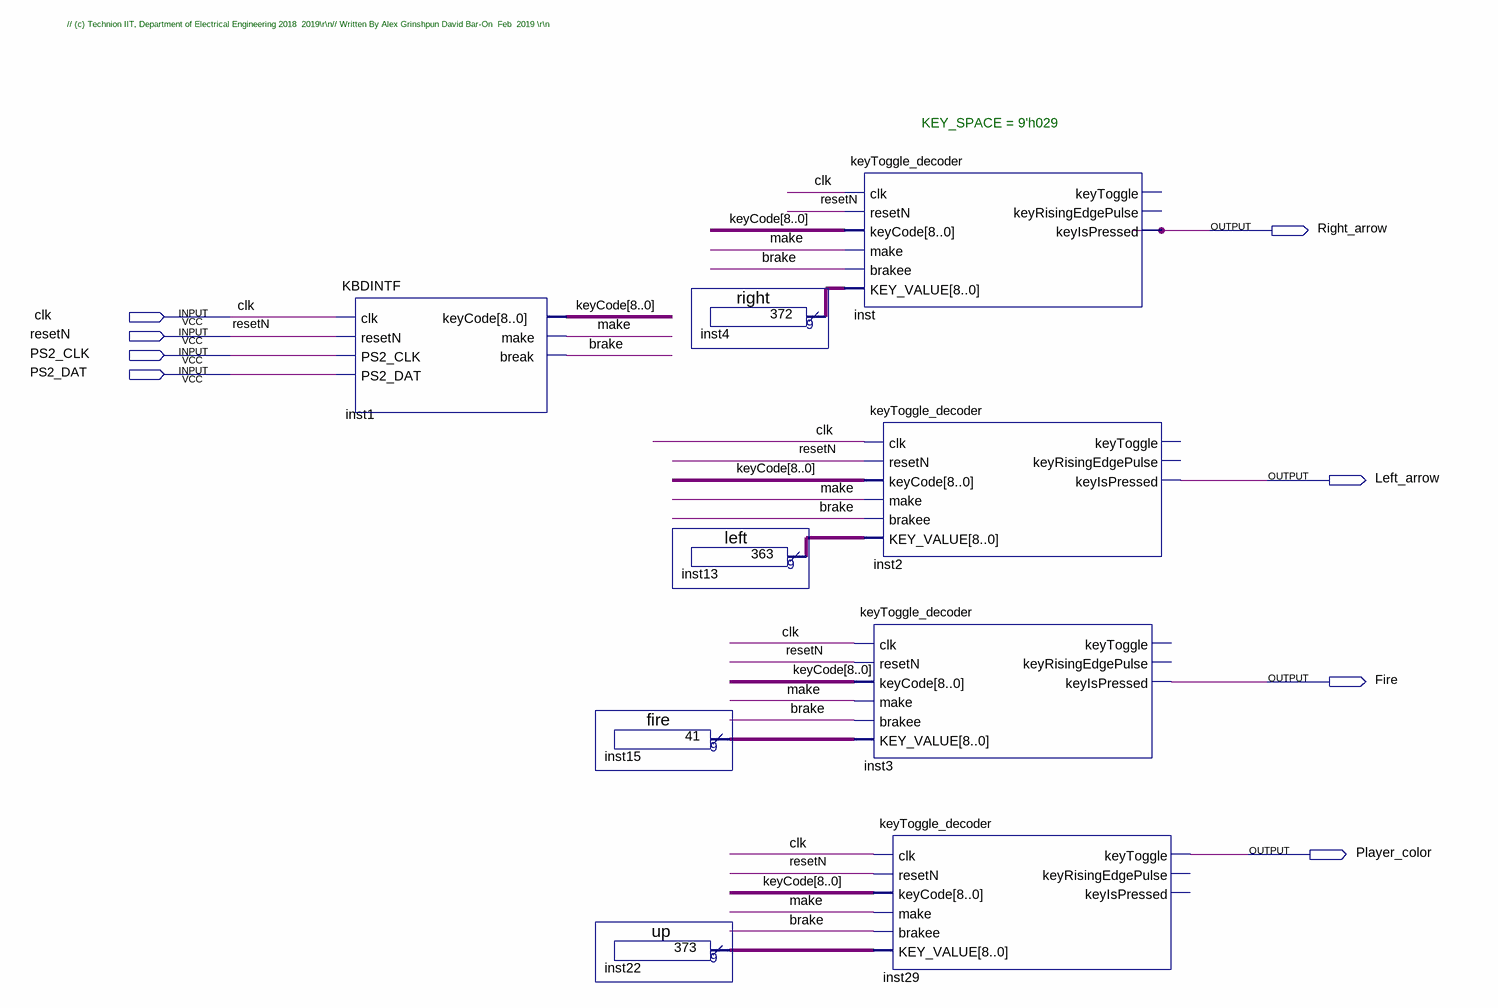
[diagram p0: schematic sheet]
// Quartus schematic Keyboard.bdf as structural Verilog: 9 symbols, 8 pins
module Keyboard (
  input  clk,
  input  resetN,
  input  PS2_CLK,
  input  PS2_DAT,
  output Right_arrow,
  output Left_arrow,
  output Fire,
  output Player_color
);

  wire brake, make;
  wire [8:0] inst4_result, inst13_result, inst15_result, inst22_result, keyCode;

  KBDINTF inst1 (
    .clk(clk), .resetN(resetN), .PS2_CLK(PS2_CLK), .PS2_DAT(PS2_DAT), .keyCode(keyCode), .make(make),
    .\break (brake));
  fire inst15 (.result(inst15_result));
  up inst22 (.result(inst22_result));
  right inst4 (.result(inst4_result));
  left inst13 (.result(inst13_result));
  keyToggle_decoder inst (
    .clk(clk), .resetN(resetN), .keyCode(keyCode), .make(make), .brakee(brake), .KEY_VALUE(inst4_result),
    .keyIsPressed(Right_arrow));  // open: keyToggle, keyRisingEdgePulse
  keyToggle_decoder inst2 (
    .clk(clk), .resetN(resetN), .keyCode(keyCode), .make(make), .brakee(brake), .KEY_VALUE(inst13_result),
    .keyIsPressed(Left_arrow));  // open: keyToggle, keyRisingEdgePulse
  keyToggle_decoder inst3 (
    .clk(clk), .resetN(resetN), .keyCode(keyCode), .make(make), .brakee(brake), .KEY_VALUE(inst15_result),
    .keyIsPressed(Fire));  // open: keyToggle, keyRisingEdgePulse
  keyToggle_decoder inst29 (
    .clk(clk), .resetN(resetN), .keyCode(keyCode), .make(make), .brakee(brake), .KEY_VALUE(inst22_result),
    .keyToggle(Player_color));  // open: keyRisingEdgePulse, keyIsPressed

  // Notes on the sheet:
  //   // (c) Technion IIT, Department of Electrical Engineering 2018  2019\r\n// Written By Alex Grinshpun David Bar-On  Feb  2019 \r\n
  //   KEY_SPACE = 9'h029
endmodule
